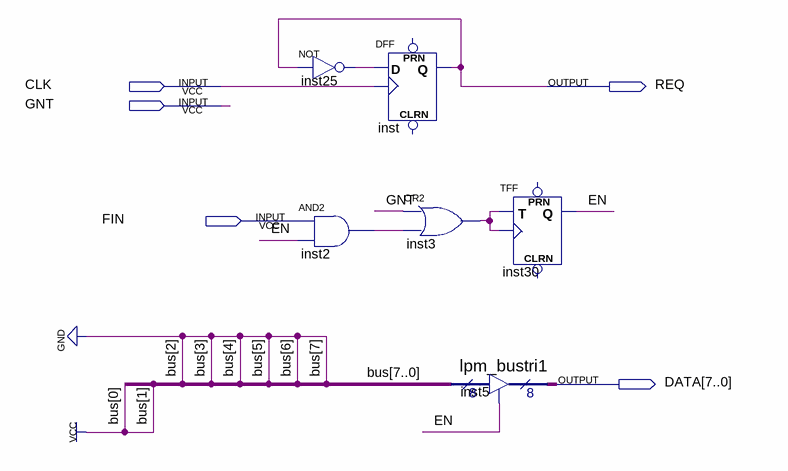
[diagram p0: schematic sheet]
// Quartus schematic master3.bdf as structural Verilog: 6 symbols, 5 pins
module master3 (
  input  CLK,
  input  GNT,
  input  FIN,
  output REQ,
  output [7:0] DATA
);

  wire EN, inst2_out, inst3_out, inst25_out;

  not inst25 (inst25_out, REQ);
  and inst2 (inst2_out, FIN, EN);
  DFF inst (.CLK(CLK), .D(inst25_out), .Q(REQ));  // open: CLRN, PRN
  or inst3 (inst3_out, GNT, inst2_out);
  lpm_bustri1 inst5 (.enabledt(EN), .data(8'b00000011), .tridata(DATA));
  TFF inst30 (.T(inst3_out), .CLK(inst3_out), .Q(EN));  // open: PRN, CLRN
endmodule
